# EasyEDA Pro project BYH_USB.epro

# Schematic Schematic1
Board Name: Board1; Create Date: 2026-05-30; Page Name: P1; Project Name: BYH_USB; Schematic Name: Schematic1; Update Date: 2026-05-30; Company: EasyEDA.com; Page Size: A4; Version: V1.0
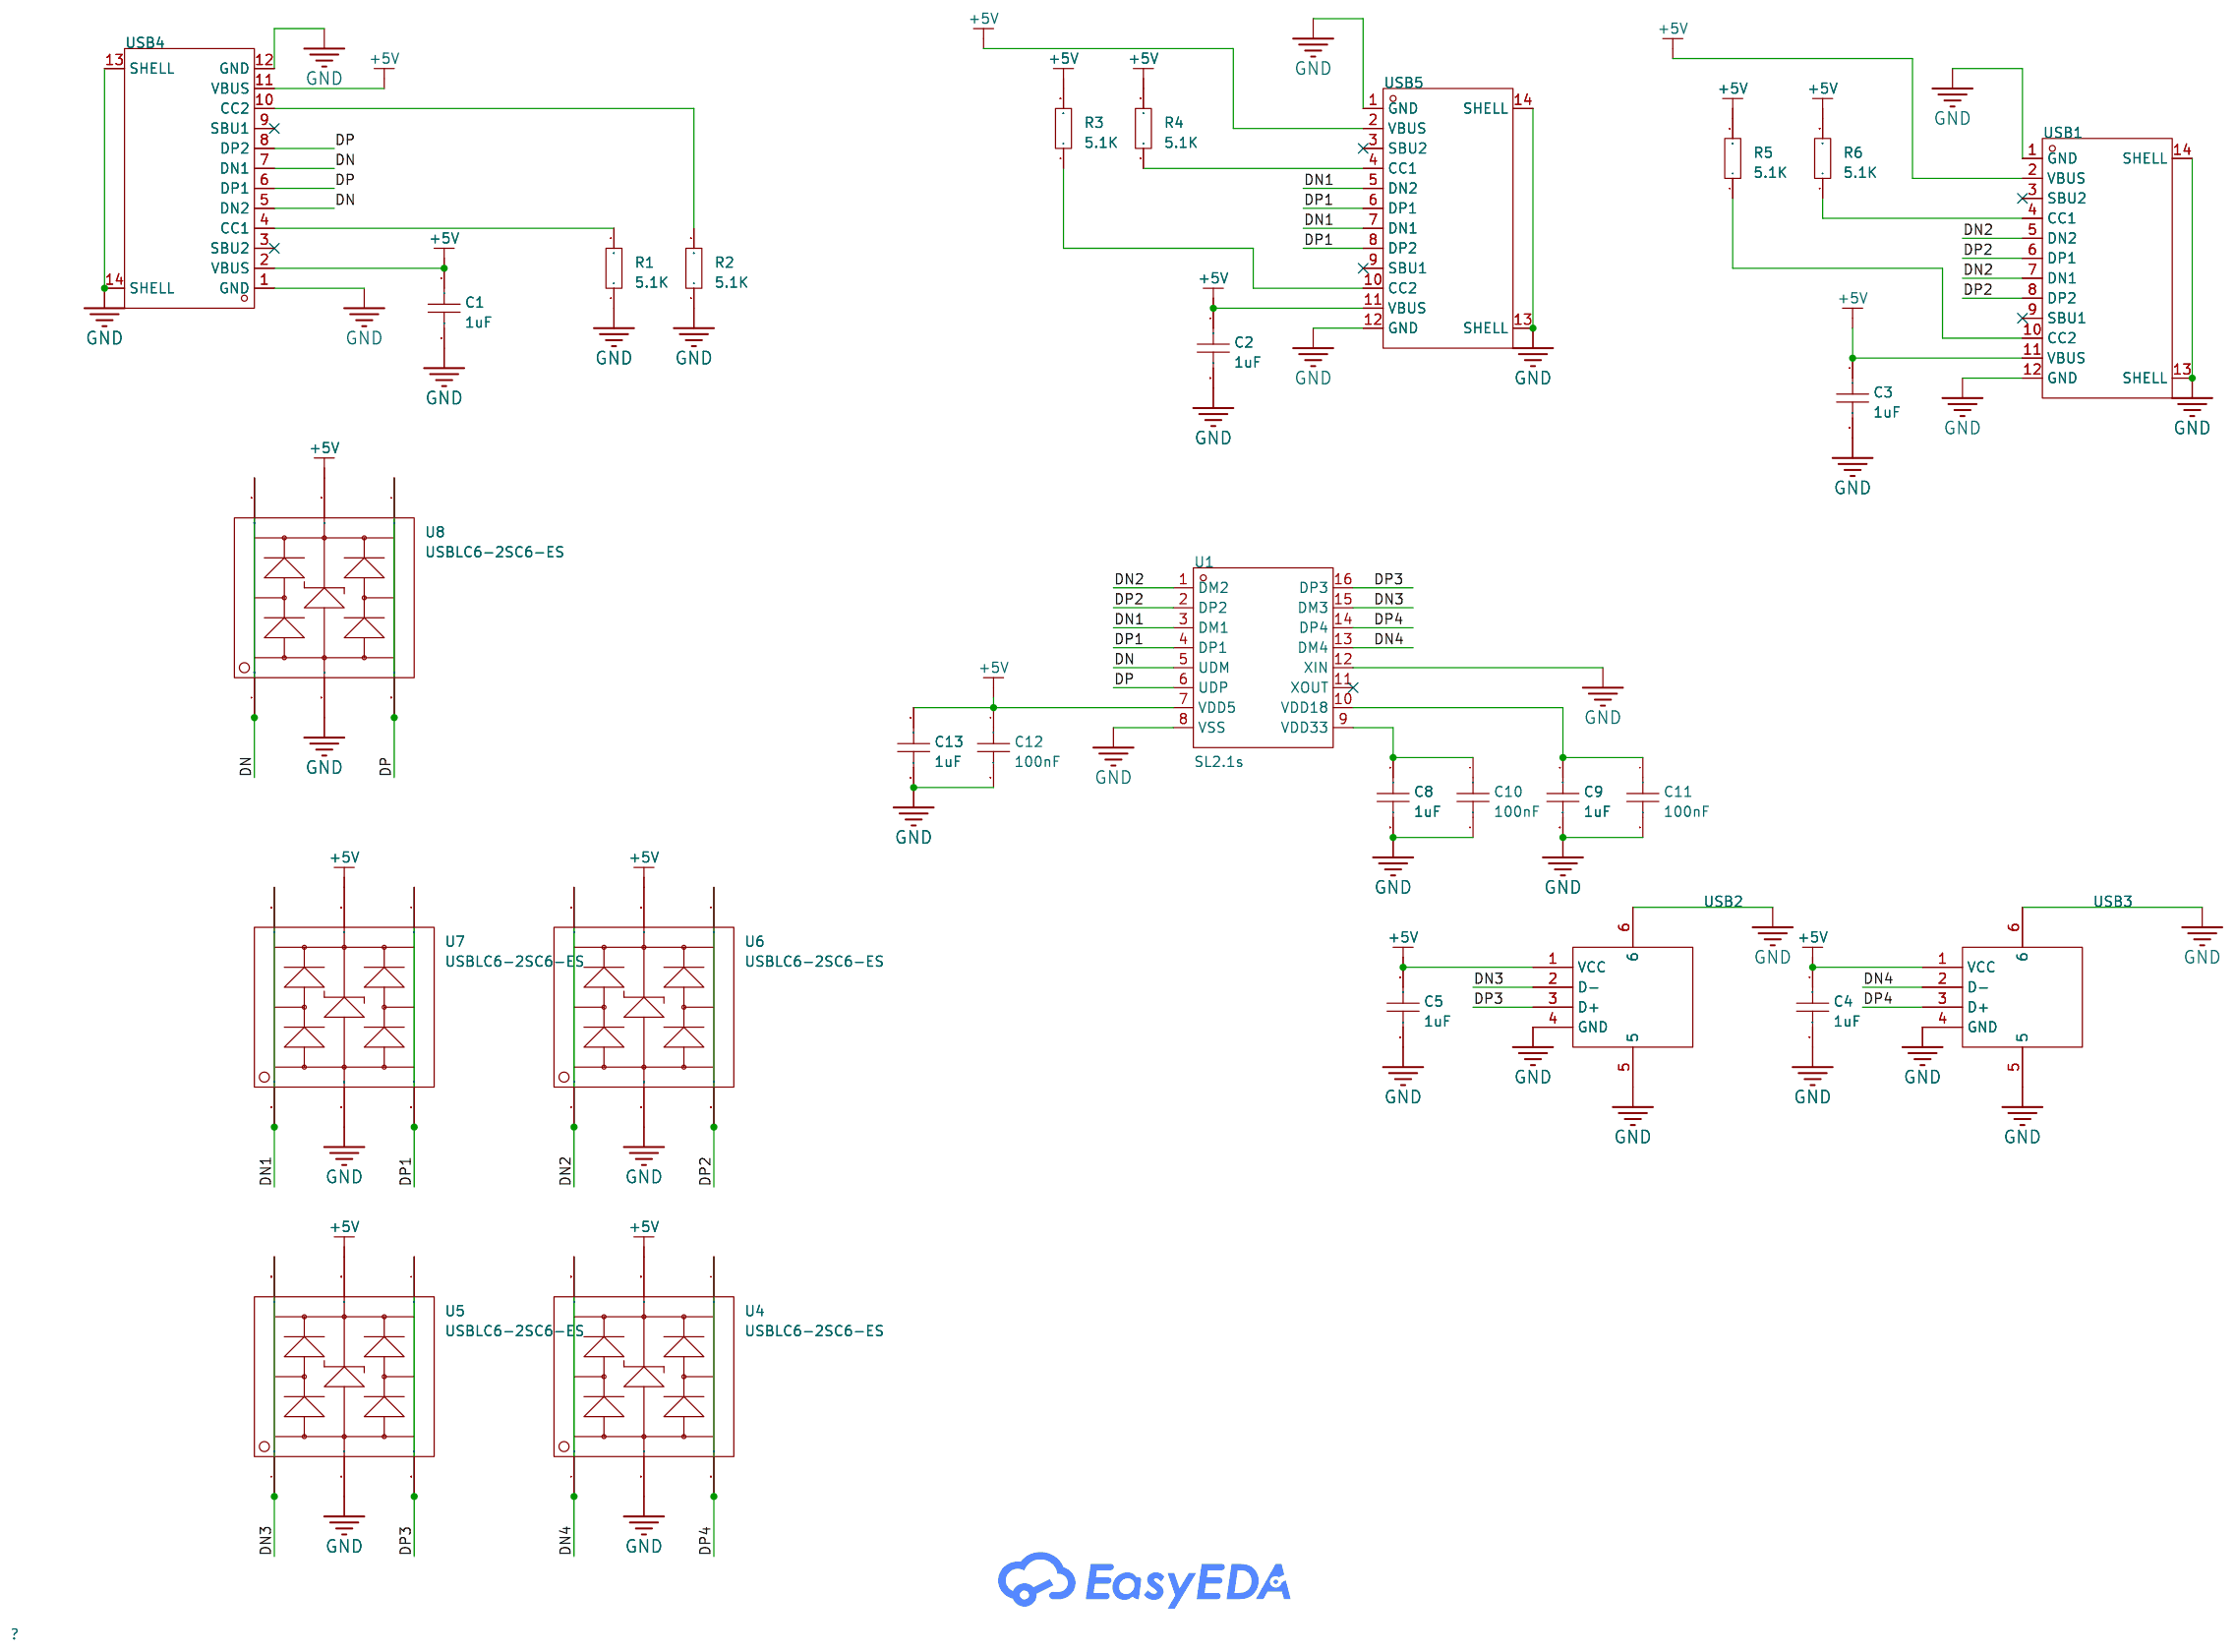
[diagram p0: schematic sheet]

## Parts
C1  1uF  [C0603]
C2  1uF  [C0603]
C3  1uF  [C0603]
C4  1uF  [C0603]
C5  1uF  [C0603]
C8  1uF  [C0603]
C9  1uF  [C0603]
C10  100nF  [C0603]
C11  100nF  [C0603]
C12  100nF  [C0603]
C13  1uF  [C0603]
R1  5.1K  [R0603]
R2  5.1K  [R0603]
R3  5.1K  [R0603]
R4  5.1K  [R0603]
R5  5.1K  [R0603]
R6  5.1K  [R0603]
U1  SL2.1s  [SSOP-16_L4.6-W2.6-P0.53-LS4.0-BL]
U4  USBLC6-2SC6-ES  [SOT-23-6_L2.9-W1.6-P0.95-LS2.8-BR]
U5  USBLC6-2SC6-ES  [SOT-23-6_L2.9-W1.6-P0.95-LS2.8-BR]
U6  USBLC6-2SC6-ES  [SOT-23-6_L2.9-W1.6-P0.95-LS2.8-BR]
U7  USBLC6-2SC6-ES  [SOT-23-6_L2.9-W1.6-P0.95-LS2.8-BR]
U8  USBLC6-2SC6-ES  [SOT-23-6_L2.9-W1.6-P0.95-LS2.8-BR]
USB1  TYPE-C 16PIN 2MD(073)  [USB-C-SMD_TYPE-C-6PIN-2MD-073]
USB2  10.0 QHHTZB6.3  [USB-A-TH_10.0QHHTZB6.3]
USB3  10.0 QHHTZB6.3  [USB-A-TH_10.0QHHTZB6.3]
USB4  TYPE-C 16PIN 2MD(073)  [USB-C-SMD_TYPE-C-6PIN-2MD-073]
USB5  TYPE-C 16PIN 2MD(073)  [USB-C-SMD_TYPE-C-6PIN-2MD-073]

## Library data of the parts
C1-C5 C8-C13 = CAP_0603: Supplier Footprint: 0603
R1-R6 = Res_0603: Supplier Footprint: 0603
U1 = SL2.1s: type:Hub USB Protocol:USB 2.0 Voltage - Supply:4V~5.25V Voltage - Supply:4V~5.25V Operating Temperature:0℃~+70℃ Operating Temperature:0℃~+70℃ Current - Supply:120mA Quiescent Supply Current:2.5mA Number of Channels:4; LCSC Part Name: USB2.0 HUB控制器集成电路; Supplier Part: C2684433; Manufacturer: CoreChips(和芯润德); Supplier Footprint: SSOP-16; JLCPCB Part Class: Extended Part; Datasheet: https://item.szlcsc.com/datasheet/SL2.1s/2782346.html; Supplier: LCSC; type: Hub; USB Protocol: USB 2.0; Voltage - Supply: 4V~5.25V; Operating Temperature: 0℃~+70℃; Current - Supply: 120mA; Quiescent Supply Current: 2.5mA; Number of Channels: 4
U4-U8 = USBLC6-2SC6-ES: Polarity:Unidirectional Reverse Stand-Off Voltage (Vrwm):5V Clamping Voltage:15V Peak Pulse Current (Ipp):4.5A Peak Pulse Power Dissipation (Ppp):- Voltage - Breakdown:6V Reverse Leakage Current (Ir):1uA Number of Channels:2 Operating Temperature:- Operat; LCSC Part Name: 2路单向+带VBUS防护ESD静电防护器件，20kV，CJ：0.6pF；HDMI/USB/RJ45高速接口通讯防护; Supplier Part: C5180249; Manufacturer: ElecSuper(静芯); Supplier Footprint: SOT23-6; JLCPCB Part Class: Extended Part; Datasheet: https://item.szlcsc.com/datasheet/USBLC6-2SC6-ES/5837587.html; Supplier: LCSC; Polarity: Unidirectional; Reverse Stand-Off Voltage (Vrwm): 5V; Clamping Voltage: 15V; Peak Pulse Current (Ipp): 4.5A; Voltage - Breakdown: 6V; Reverse Leakage Current (Ir): 1uA; Number of Channels: 2; Type: ESD
USB1 USB4 USB5 = TYPE-C 16PIN 2MD(073): Connector Type:Type-C Protocol Standard:- Gender:Female Mounting Type:Surface Mount, Right Angle Number of Contacts:16P Number of Ports:1 Current Rating-Power:3A Voltage Rating:5V Connect-Disconnect Life:5,000 times Supplementary Features:- Center Height:; LCSC Part Name: 16P卧贴母座; Supplier Part: C2765186; Manufacturer: SHOU HAN(首韩); Supplier Footprint: SMD; JLCPCB Part Class: Extended Part; Datasheet: https://item.szlcsc.com/datasheet/TYPE-C%252016PIN%25202MD(073)/2901843.html; Supplier: LCSC; Connector Type: Type-C; Gender: Female; Mounting Type: Surface Mount, Right Angle; Number of Contacts: 16P; Number of Ports: 1; Current Rating-Power: 3A; Voltage Rating: 5V; Connect-Disconnect Life: 5,000 times; Detection color: Black; Operating Temperature: -25℃~+85℃
USB2 USB3 = 10.0 QHHTZB6.3: Connector Type:Type-A Protocol Standard:USB 2.0 Gender:Female Mounting Type:Surface Mount, Right Angle Number of Contacts:4P Number of Ports:1 Current Rating-Power:1.5A Voltage Rating:30V Connect-Disconnect Life:5,000 times Supplementary Features:- Center; LCSC Part Name: 壳长10.0mm; Supplier Part: C668591; Manufacturer: SHOU HAN(首韩); Supplier Footprint: SMD; JLCPCB Part Class: Extended Part; Datasheet: https://item.szlcsc.com/datasheet/10.0%2520QHHTZB6.3/698534.html; Supplier: LCSC; Connector Type: Type-A; Protocol Standard: USB 2.0; Gender: Female; Mounting Type: Surface Mount, Right Angle; Number of Contacts: 4P; Number of Ports: 1; Current Rating-Power: 1.5A; Voltage Rating: 30V; Connect-Disconnect Life: 5,000 times; Length: 10mm; Detection color: Black; Operating Temperature: -25℃~+85℃

## Nets
+5V: C1.1 C2.1 C3.1 C4.1 C5.1 C12.1 C13.1 R3.2 R4.2 R5.2 R6.2 U1.7(VDD5) U4.5(VCC) U5.5(VCC) U6.5(VCC) U7.5(VCC) U8.5(VCC) USB1.2(VBUS) USB1.11(VBUS) USB2.1(VCC) USB3.1(VCC) USB4.2(VBUS) USB4.11(VBUS) USB5.2(VBUS) USB5.11(VBUS)
GND: C1.2 C2.2 C3.2 C4.2 C5.2 C8.2 C9.2 C10.2 C11.2 C12.2 C13.2 R1.1 R2.1 U1.8(VSS) U1.12(XIN) U4.2(GND) U5.2(GND) U6.2(GND) U7.2(GND) U8.2(GND) USB1.1(GND) USB1.12(GND) USB1.13(SHELL) USB1.14(SHELL) USB2.4(GND) USB2.5 USB2.6 USB3.4(GND) USB3.5 USB3.6 USB4.1(GND) USB4.12(GND) USB4.13(SHELL) USB4.14(SHELL) USB5.1(GND) USB5.12(GND) USB5.13(SHELL) USB5.14(SHELL)
DN: U1.5(UDM) U8.1(I/O1) U8.6(I/O1) USB4.5(DN2) USB4.7(DN1)
DN1: U1.3(DM1) U7.1(I/O1) U7.6(I/O1) USB5.5(DN2) USB5.7(DN1)
DN2: U1.1(DM2) U6.1(I/O1) U6.6(I/O1) USB1.5(DN2) USB1.7(DN1)
DN3: U1.15(DM3) U5.1(I/O1) U5.6(I/O1) USB2.2(D-)
DN4: U1.13(DM4) U4.1(I/O1) U4.6(I/O1) USB3.2(D-)
DP: U1.6(UDP) U8.3(I/O2) U8.4(I/O2) USB4.6(DP1) USB4.8(DP2)
DP1: U1.4(DP1) U7.3(I/O2) U7.4(I/O2) USB5.6(DP1) USB5.8(DP2)
DP2: U1.2(DP2) U6.3(I/O2) U6.4(I/O2) USB1.6(DP1) USB1.8(DP2)
DP3: U1.16(DP3) U5.3(I/O2) U5.4(I/O2) USB2.3(D+)
DP4: U1.14(DP4) U4.3(I/O2) U4.4(I/O2) USB3.3(D+)
$1N1052: R1.2 USB4.4(CC1)
$1N1056: R2.2 USB4.10(CC2)
$1N1650: R6.1 USB1.4(CC1)
$1N1678: R5.1 USB1.10(CC2)
$1N1682: R3.1 USB5.10(CC2)
$1N1692: R4.1 USB5.4(CC1)
$1N2186: C8.1 C10.1 U1.9(VDD33)
$1N2191: C9.1 C11.1 U1.10(VDD18)

Not connected (* = marked no-connect by the designer): U1 11(XOUT)*; USB1 3(SBU2)* 9(SBU1)*; USB4 3(SBU2)* 9(SBU1)*; USB5 3(SBU2)* 9(SBU1)*

# Board PCB1
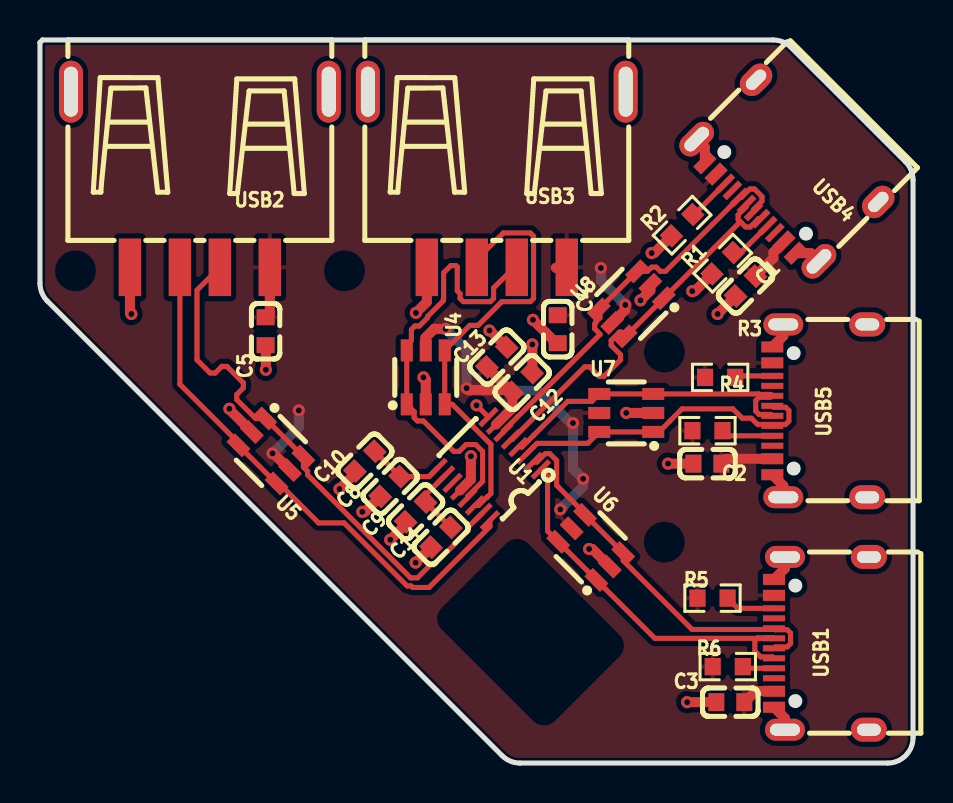
[diagram p1: board, top side]
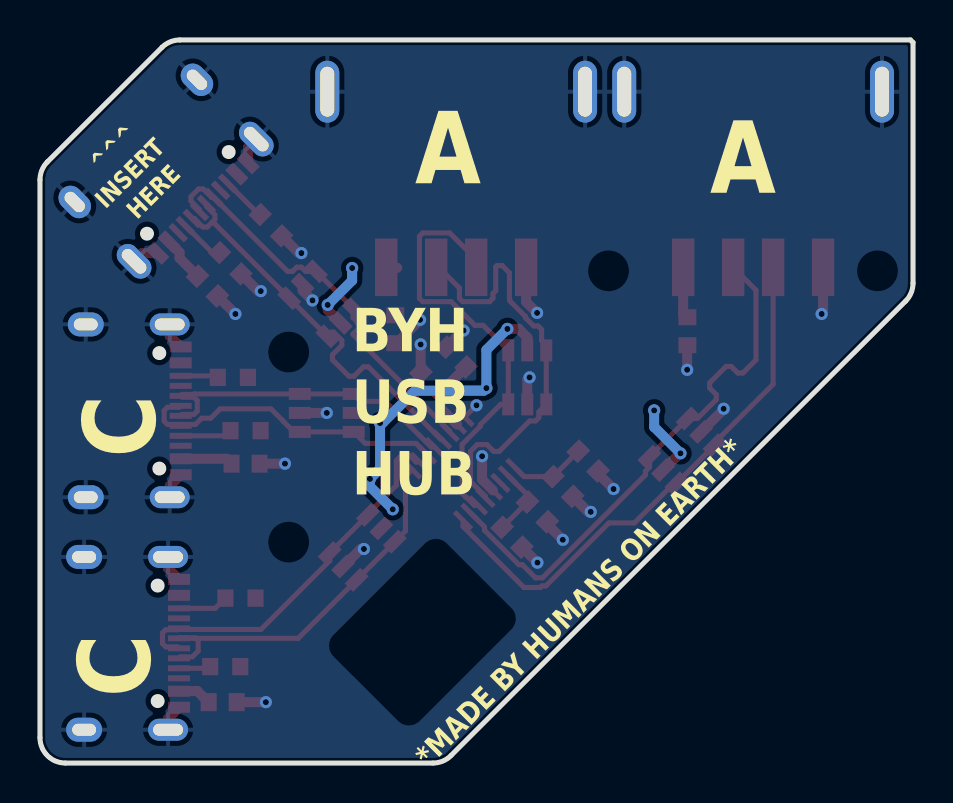
[diagram p2: board, bottom side, seen from below]

Outline 43.69 x 36.19 mm; copper layers: Top Layer, Bottom Layer. Coordinates in mm from the lower left corner of the outline.
Outline path: 0,36.07 0.13,36.19 36.69,36.19 arc(37.17,36.1) 37.58,35.82 43.32,30.09 arc(43.59,29.68) 43.69,29.19 43.69,1.27 arc(43.32,0.37) 42.42,0 24.02,0 arc(23.53,0.1) 23.12,0.37 0.37,23.12 arc(0.1,23.54) 0,24.02 0,36.07
Stack: Top Layer 0.035mm / Dielectric1 1.51mm FR4 er 4.5 / Bottom Layer 0.035mm

## Design rules (mm)
net DN2: DP2
net DP2: DP2
net DN1: DP1
net DP1: DP1
net DN: DP
net DP: DP
net DN4: DP4
net DP4: DP4
net DN3: DP3
net DP3: DP3
template: JLCPCB Capability(Two Layers Board)
spacing copperThickness1oz (default): track to track 0.102, other pairs 0.152 to 0.3
spacing copperThickness2oz: track to track 0.203, other pairs 0.152 to 0.3
track width copperThickness1oz (default): min 0.127, default 0.254, max 2.54
track width copperThickness2oz: min 0.203, default 0.254, max 2.54
differential pair differentialPair (default): width min 0.127, default 0.254, max 2.54; gap min 0.152, default 0.152
via viaSize (default): diameter min 0.5, default 0.61, max 10; hole min 0.3, default 0.305, max 6.3

## Placement (name value [footprint] x y rotation side)
C1  1uF  [C0603]  35.31 23.88 225 top
C2  1uF  [C0603]  33.4 14.99 180 top
C3  1uF  [C0603]  34.54 3.05 180 top
C4  1uF  [C0603]  25.91 21.72 270 top
C5  1uF  [C0603]  11.29 21.61 270 top
C8  1uF  [C0603]  17.53 13.84 225 top
C9  1uF  [C0603]  18.8 12.57 225 top
C10  100nF  [C0603]  16.26 15.11 225 top
C11  100nF  [C0603]  20.07 11.3 225 top
C12  100nF  [C0603]  24.13 19.05 45 top
C13  1uF  [C0603]  22.86 20.32 45 top
R1  5.1K  [R0603]  34.16 25.02 45 top
R2  5.1K  [R0603]  32.13 26.92 45 top
R3  5.1K  [R0603]  34.04 19.3 180 top
R4  5.1K  [R0603]  33.4 16.64 180 top
R5  5.1K  [R0603]  33.66 8.25 180 top
R6  5.1K  [R0603]  34.42 4.83 180 top
U1  SL2.1s  [SSOP-16_L4.6-W2.6-P0.53-LS4.0-BL]  22.48 14.73 135 top
U4  USBLC6-2SC6-ES  [SOT-23-6_L2.9-W1.6-P0.95-LS2.8-BR]  19.3 19.3 270 top
U5  USBLC6-2SC6-ES  [SOT-23-6_L2.9-W1.6-P0.95-LS2.8-BR]  11.56 15.62 135 top
U6  USBLC6-2SC6-ES  [SOT-23-6_L2.9-W1.6-P0.95-LS2.8-BR]  27.56 10.8 315 top
U7  USBLC6-2SC6-ES  [SOT-23-6_L2.9-W1.6-P0.95-LS2.8-BR]  29.34 17.53 0 top
U8  USBLC6-2SC6-ES  [SOT-23-6_L2.9-W1.6-P0.95-LS2.8-BR]  29.59 22.99 45 top
USB1  TYPE-C 16PIN 2MD(073)  [USB-C-SMD_TYPE-C-6PIN-2MD-073]  39.1 5.99 90 top
USB2  10.0 QHHTZB6.3  [USB-A-TH_10.0QHHTZB6.3]  8 29.21 180 top
USB3  10.0 QHHTZB6.3  [USB-A-TH_10.0QHHTZB6.3]  22.86 29.21 180 top
USB4  TYPE-C 16PIN 2MD(073)  [USB-C-SMD_TYPE-C-6PIN-2MD-073#2]  37.21 29.46 135 top
USB5  TYPE-C 16PIN 2MD(073)  [USB-C-SMD_TYPE-C-6PIN-2MD-073]  39.02 17.63 90 top

## Footprints (pads in the part's own frame, mm; a bottom-side part is the same pattern mirrored in y, then rotated)
C0603
  rect 0.8x0.9 smd: 1(-0.7,0) 2(0.7,0)
R0603
  rect 0.806x0.864 smd: 1(-0.753,0) 2(0.753,0)
SOT-23-6_L2.9-W1.6-P0.95-LS2.8-BR
  rect 1.1x0.6 smd: 1(1.35,-0.95) 2(1.35,0) 3(1.35,0.95) 4(-1.35,0.95) 5(-1.35,0) 6(-1.35,-0.95)
SSOP-16_L4.6-W2.6-P0.53-LS4.0-BL
  rect 0.25x1.2 smd: 1(-1.855,-1.8) 2(-1.325,-1.8) 3(-0.795,-1.8) 4(-0.265,-1.8) 5(0.265,-1.8) 6(0.795,-1.8) 7(1.325,-1.8) 8(1.855,-1.8) 9(1.855,1.8) 10(1.325,1.8) 11(0.795,1.8) 12(0.265,1.8) 13(-0.265,1.8) 14(-0.795,1.8) 15(-1.325,1.8) 16(-1.855,1.8)
USB-A-TH_10.0QHHTZB6.3
  rect 1.12x2.88 smd: 1(-3.5,4.395) 2(-1,4.395) 3(1,4.395) 4(3.5,4.395)
  oval 1.2x3.1 hole 0.7x2.5: 5(-6.45,-4.395) 6(6.45,-4.395)
USB-C-SMD_TYPE-C-6PIN-2MD-073
  rect 0.55x1.1 smd: 1(-3.2,2.375) 2(-2.4,2.375) 11(2.4,2.375) 12(3.2,2.375)
  rect 0.3x1.1 smd: 3(-1.75,2.375) 4(-1.25,2.375) 5(-0.75,2.375) 6(-0.25,2.375) 7(0.25,2.375) 8(0.75,2.375) 9(1.25,2.375) 10(1.75,2.375)
  oval 1.1x2 hole 0.6x1.5: 13(-4.325,1.825) 14(4.325,1.825)
  oval 1.2x1.8 hole 0.6x1.2: 13(-4.325,-2.375) 14(4.325,-2.375)
USB-C-SMD_TYPE-C-6PIN-2MD-073#2
  rect 0.55x1.1 smd: 1(-3.2,2.375) 2(-2.4,2.375) 11(2.4,2.375) 12(3.2,2.375)
  rect 0.3x1.1 smd: 3(-1.75,2.375) 4(-1.25,2.375) 5(-0.75,2.375) 6(-0.25,2.375) 7(0.25,2.375) 8(0.75,2.375) 9(1.25,2.375) 10(1.75,2.375)
  oval 1.1x2 hole 0.6x1.5: 13(-4.325,1.825) 14(4.325,1.825)
  oval 1.2x1.8 hole 0.6x1.2: 13(-4.325,-2.375) 14(4.325,-2.375)

## Nets
As in the schematic.

Pads without a net: U1 11; USB1 3 9; USB4 3 9; USB5 3 9

## Via types
v1: diameter 0.61, hole 0.305, Top Layer to Bottom Layer, 31 vias

## Routing (per net, layer and track width the routed paths; a pad name or vN(x,y) marks a point on that pad's centre or on a via; arc(x,y) is an arc through that point)
+5V: length 38.9
  Top Layer w0.5: 23.42,18.77 23.33,18.68 21.44,18.68 v1(21.35,18.77) ; 23.42,18.77 22.37,19.83 ; 23.42,18.77 C12.1 23.63,17.76 22.81,16.94 ; v1(20.3,21.73) 19.76,21.73 19.75,21.74 19.73,21.74 19.29,21.3 19.29,20.66 U4.5 ; C1.1 36.7,25.27 36.7,25.56 USB4.2 ; USB1.2 36.72,3.6 35.81,3.6 35.51,3.3 35.5,3.3 C3.1 ; USB5.2 34.35,15.23 C2.1 ; U5.5 11.68,15.5 v1(11.64,15.5) ; 25.82,24.78 25.81,24.79 ; USB2.1 11.5,22.53 C5.1 ; v1(29.29,22.93) 29.29,22.69 U8.5
  Bottom Layer w0.5: v1(26.03,12.7) 27.18,13.84 v1(27.18,14.22) 26.67,14.73 v1(26.67,17.02) 26.54,17.02 24.92,18.64 21.47,18.64 v1(21.35,18.77) 21.35,20.68 v1(20.3,21.73) ; v1(29.29,22.93) 28.07,24.15 v1(28.07,24.78) ; v1(11.64,15.5) 12.95,16.82 v1(12.95,17.65)
GND: length 39.6
  Top Layer w0.254: U1.8 21.85,17.91 v1(21.84,17.91)
  Top Layer w0.5: USB1.14 37.28,9.74 USB1.12 ; C11.2 v1(18.8,10.03) ; v1(17.53,11.18) 18.3,11.95 18.3,12.08 ; R2.1 30.73,25.53 v1(30.61,25.53) ; USB5.1 37.2,13.88 USB5.13 ; USB4.1 38.57,25.52 USB4.13 ; v1(22.49,21.65) 22.52,21.65 23.35,20.81 ; C4.2 25.84,21.02 v1(24.67,22.19) ; USB5.12 37.2,21.38 USB5.14 ; U7.2 v1(29.34,17.53) ; v1(4.57,22.48) 4.5,22.55 USB2.4 ; C5.2 11.3,20.9 v1(11.3,19.69) ; C8.2 16.26,12.57 v1(16.13,12.57) ; v1(27.48,10.71) 27.64,10.71 U6.2 ; C3.2 v1(32.38,3.05) ; U5.2 9.48,17.7 v1(9.48,17.73) ; 19.3,17.95 19.3,19.19 v1(19.19,19.3) ; R1.1 32.77,23.62 v1(32.64,23.62) ; U8.2 30.55,23.65 v1(30.05,23.16) ; C1.2 v1(33.91,22.48) ; USB1.1 37.28,2.24 USB1.13 ; 21.02,13.65 21.56,14.19 v1(21.56,15.36) ; v1(24.64,20.95) 24.64,19.56 C12.2 ; USB4.12 33.27,30.83 USB4.14 ; 15.76,14.62 15.76,14.49 v1(14.99,13.72) ; USB3.4 19.36,23.08 v1(18.81,22.53) ; 32.7,14.99 v1(31.43,14.99)
DN: length 20.2
  Top Layer w0.254: 35.1,27.04 34.99,27.04 U8.1 U8.6 29.1,21.57 28.99,21.57 28.58,21.16 28.58,20.91 29.05,20.44 29.05,20.19 28.23,19.36 27.97,19.36 27.51,19.83 27.25,19.83 23.62,16.19 U1.5 ; 35.1,27.04 35.31,26.83 35.54,26.83 35.96,27.25 USB4.5 ; 35.1,27.04 34.93,27.21 34.93,27.44 35.35,27.86 35.35,27.96
DN1: length 16
  Top Layer w0.254: U1.3 24.87,16 27.41,16 U7.6 U7.1 30.77,16.66 31.07,16.66 31.52,17.11 31.52,17.12 32.13,17.73 34.67,17.73 35.14,17.26 35.6,17.26 35.91,16.95 36.57,16.95 USB5.5 36.72,16.95 37.31,16.95 37.47,17.12 37.47,17.65 37.31,17.81 36.72,17.81 USB5.7
DN2: length 19.4
  Top Layer w0.254: 35.88,6.24 35.77,6.14 35.77,5.6 36.06,5.31 36.66,5.31 USB1.5 ; 35.88,6.24 35.9,6.27 36.71,6.27 USB1.7 35.88,6.24 ; 35.88,6.24 30.77,6.24 U6.1 U6.6 25.4,11.61 25.4,14.36 U1.1
DN3: length 27
  Top Layer w0.254: USB2.2 7.86,23.67 7.86,20.18 8.51,19.52 8.77,19.52 9.1,19.85 9.35,19.85 10.18,19.03 10.18,18.78 9.85,18.45 9.85,18.19 10.79,17.25 U5.1 13.18,15.34 13.18,14.81 13.39,14.61 13.39,14.42 18.54,9.27 18.89,9.27 19.55,9.93 19.72,9.93 21.44,11.65 21.44,11.82 U1.15
DN4: length 21.8
  Top Layer w0.254: 21.39,13.27 21.39,13.34 22.15,14.1 22.15,15.6 21.81,15.94 21.32,15.94 20.98,15.6 20.71,15.6 19.18,17.12 18.89,17.12 18.72,17.29 18.72,17.58 18.35,17.95 U4.6 18.35,20.93 18.59,21.16 18.59,21.7 18.76,21.88 18.98,21.88 19.4,22.29 19.4,22.35 20.19,23.14 20.19,23.25 20.2,23.26 20.2,24.54 20.56,24.9 20.82,24.9 20.88,24.84 20.88,23.64 21.02,23.5 21.02,23.26 21.18,23.1 22.54,23.1 22.7,23.26 22.7,23.78 23.73,24.81 USB3.2
DP: length 20.3
  Top Layer w0.254: 35.71,27.61 35.71,27.71 36.13,28.13 36.13,28.36 35.75,28.74 35.52,28.74 35.1,28.31 USB4.8 31.3,24.61 31.05,24.61 30.84,24.82 30.61,24.82 30.4,24.61 U8.3 U8.4 28.02,22.65 28.02,22.29 27.81,22.08 27.81,22.03 27.76,21.97 27.76,21.74 28.02,21.48 28.02,21.45 23.19,16.62 U1.6
DP1: length 16.1
  Top Layer w0.254: 36.57,18.31 35.98,18.31 35.82,18.15 35.82,17.62 35.98,17.45 36.57,17.45 USB5.6 ; USB5.8 36.57,18.45 35.98,18.45 35.96,18.48 U7.3 U7.4 27.62,18.11 26.41,18.11 24.71,16.41 24.7,16.41 24.11,15.82 U1.4
DP2: length 19.2
  Top Layer w0.254: USB1.6 36.8,5.81 37.39,5.81 37.56,5.98 37.56,6.51 37.39,6.67 36.8,6.67 USB1.8 36.67,6.69 32.63,6.69 29.19,10.13 U6.3 U6.4 27.28,12.48 25.85,13.9 25.85,15.14 25.51,15.48 25.28,15.48 24.87,15.07 24.69,15.07
DP3: length 27.2
  Top Layer w0.254: U1.16 22.52,11.84 19.47,8.79 18.65,8.79 18.57,8.86 18.37,8.86 15.22,12.02 13.94,12.02 11.97,13.99 U5.4 9.93,15.9 9.93,16.03 7,18.96 USB2.3
DP4: length 21.9
  Top Layer w0.254: U1.14 21.95,12.9 22.36,13.31 22.39,13.31 22.57,13.49 22.57,15.95 21.65,16.86 21.65,16.94 20.63,17.95 20.25,17.95 U4.4 21.51,21.91 21.92,21.91 23.11,23.1 24.54,23.1 24.7,23.26 24.7,26.37 24.54,26.53 23.18,26.53 21.86,25.21 USB3.3
$1N1052: length 2.3
  Top Layer w0.254: USB4.4 35.07,25.55 R1.2
$1N1056: length 2.3
  Top Layer w0.254: R2.2 32.73,27.46 34.29,29.02
$1N1650: length 1.6
  Top Layer w0.254: R6.1 35.25,4.74 USB1.4
$1N1678: length 2.5
  Top Layer w0.254: R5.1 34.92,7.74 USB1.10
$1N1682: length 1.9
  Top Layer w0.254: R3.1 34.87,19.38 USB5.10
$1N1692: length 2.6
  Top Layer w0.254: USB5.4 34.41,16.38 R4.1
$1N2186: length 3.8
  Top Layer w0.254: 16.75,15.61 C8.1 19.46,14.34 U1.9
$1N2191: length 3.5
  Top Layer w0.254: C11.1 19.29,13.07 19.29,13.42 20.27,14.4

## Copper pours and planes (outline as drawn; the poured copper is in the pictures)
+5V on Top Layer: -2.54,39.5 48.01,39.5 48.01,-0.89 -2.54,-0.89
GND on Bottom Layer: -2.03,38.86 47.88,38.86 47.88,-1.14 -2.03,-1.14

## Text on the board
Bottom Silkscreen Layer: ^^^ / INSERT / HERE | *MADE BY HUMANS ON EARTH* | BYH / USB / HUB | A | C
